# EAGLE design untitled (EAGLE 7.7.0)
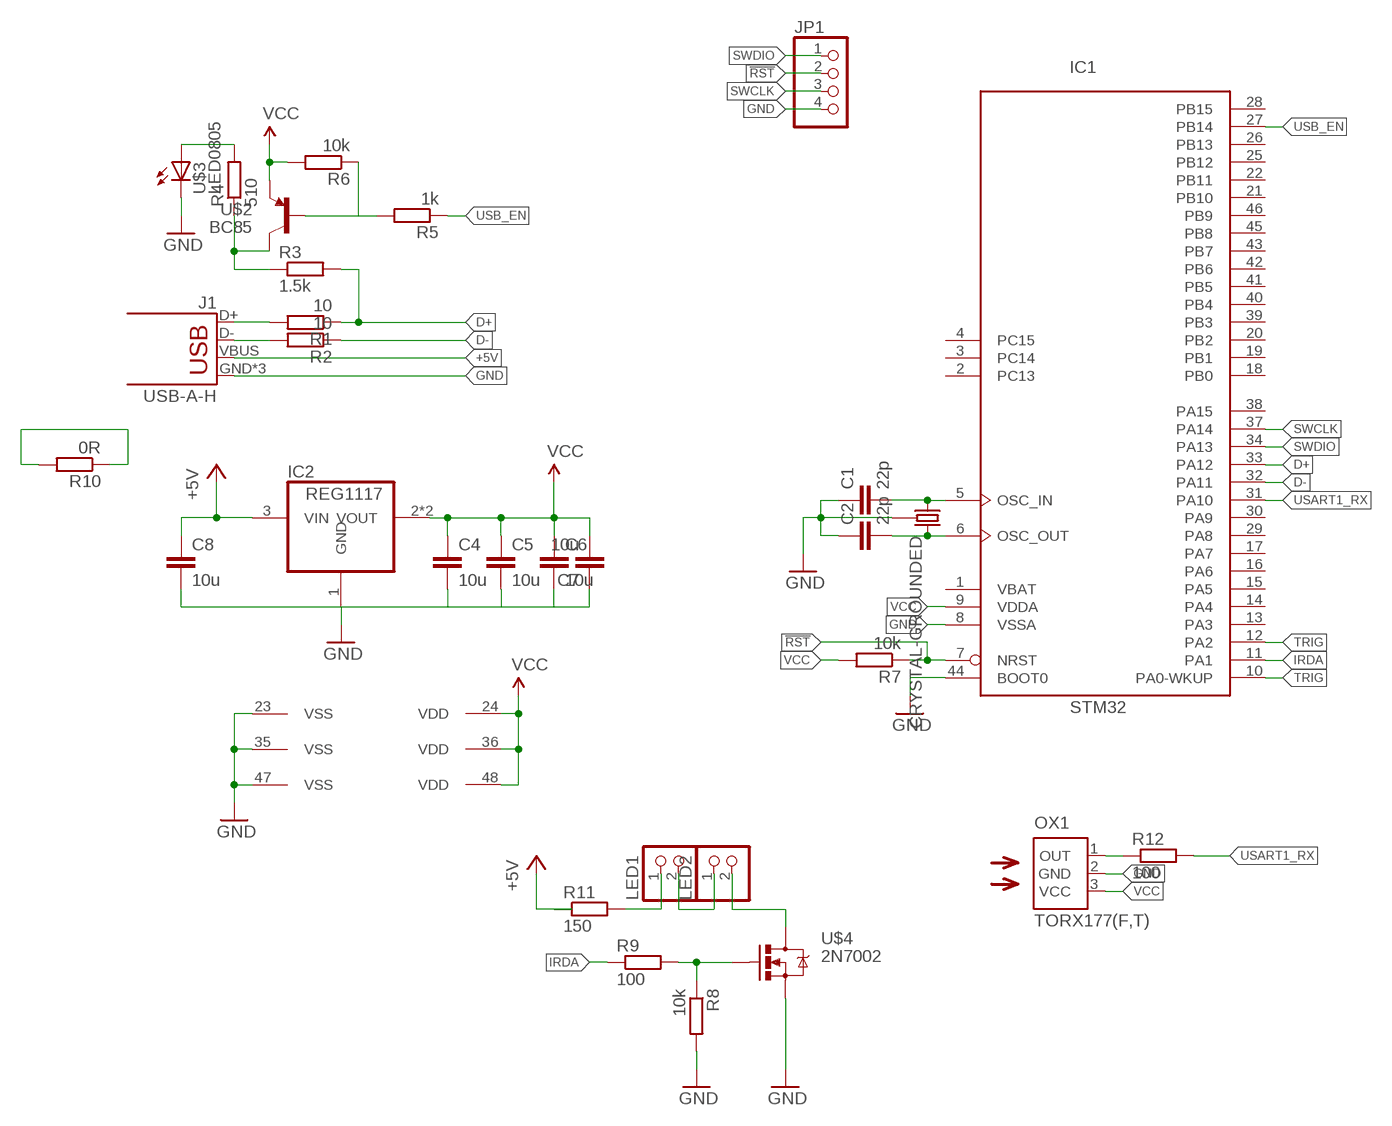
[diagram p0: schematic, sheet 1]

## Parts
C1  22p  CC0603  [C0603]
C2  22p  CC0603  [C0603]
C4  10u  CC0805  [C0805]
C5  10u  CC0805  [C0805]
C6  10u  CC0805  [C0805]
C7  10u  CC0805  [C0805]
C8  10u  CC0805  [C0805]
IC1  STM32  STM32F103C8T  [LQFP48]
IC2  REG1117  [SOT223]
J1  USB-A-H  [USB-A-H]
JP1  PINHD-1X4  [1X04]
LED1  PINHD-1X2  [1X02]
LED2  PINHD-1X2  [1X02]
OX1  TORX177(F,T)  [TORX]
R1  10  R0603  [0603]
R2  10  R0603  [0603]
R3  1.5k  R0603  [0603]
R4  510  R0603  [0603]
R5  1k  R0603  [0603]
R6  10k  R0603  [0603]
R7  10k  R0603  [0603]
R8  10k  R0603  [0603]
R9  100  R0603  [0603]
R10  0R  R0603  [0603]
R11  150  R0603  [0603]
R12  100  R0603  [0603]
U$1  CRYSTAL-GROUNDED  [CRYSTAL-SMD-5X3]
U$2  BC85  [SOT23]
U$3  LED0805  [0805-LED]
U$4  2N7002  [SOT23]

## Nets
5VRLED: LED1.1 R11.2
!RST: IC1.7(NRST) JP1.2 R7.1
+5V: C8.1 IC2.3(VIN) J1.VBUS R11.1
D+: IC1.33(PA12) R1.1 R3.2
D-: IC1.32(PA11) R2.1
GND: C1.1 C2.1 C4.2 C5.2 C6.2 C7.1 C8.2 IC1.8(VSSA) IC1.23(VSS) IC1.35(VSS) IC1.44(BOOT0) IC1.47(VSS) J1.GND J1.GND2(GND) J1.GND3(GND) JP1.4 OX1.2(GND) R8.2 U$1.2 U$1.4 U$3.C U$4.2(S)
IRDA: IC1.11(PA1) R9.1
N$1: C2.2 IC1.6(OSC_OUT) U$1.1
N$2: C1.2 IC1.5(OSC_IN) U$1.3
N$3: R8.1 R9.2 U$4.1(G)
N$4: LED2.2 U$4.3(D)
N$5: J1.D- R2.2
N$6: J1.D+ R1.2
N$7: LED1.2 LED2.1
N$9: R3.1 R4.1 U$2.3(C)
N$10: R4.2 U$3.A
N$13: R5.2 R6.1 U$2.1(B)
SWCLK: IC1.37(PA14) JP1.3
SWDIO: IC1.34(PA13) JP1.1
TRIG: IC1.10(PA0-WKUP) IC1.12(PA2)
USART1_RX: IC1.31(PA10) R12.2
USART1_RXR: OX1.1(OUT) R12.1
USB_EN: IC1.27(PB14) R5.1
VCC: C4.1 C5.1 C6.1 C7.2 IC1.9(VDDA) IC1.24(VDD) IC1.36(VDD) IC1.48(VDD) IC2.2(VOUT) IC2.4(VOUT) OX1.3(VCC) R6.2 R7.2 R10.1 R10.2 U$2.2(E)
Unconnected: IC1.2(PC13) IC1.3(PC14) IC1.4(PC15) IC1.13(PA3) IC1.14(PA4) IC1.15(PA5) IC1.16(PA6) IC1.17(PA7) IC1.18(PB0) IC1.19(PB1) IC1.20(PB2) IC1.21(PB10) IC1.22(PB11) IC1.25(PB12) IC1.26(PB13) IC1.28(PB15) IC1.29(PA8) IC1.30(PA9) IC1.38(PA15) IC1.39(PB3) IC1.40(PB4) IC1.41(PB5) IC1.42(PB6) IC1.43(PB7) IC1.45(PB8) IC1.46(PB9)

## Power pins joined to a net without a drawn wire
GND: IC2.1(GND)
VBAT: IC1.1(VBAT)

## Library data of the parts
C1 C2 C4-C8 = smalsmd:C: Capacitor
IC1 = micro-stm_v3:STM32F103C*T: ARM 32-bit Cortex™-M3 CPU 72 MHz maximum frequency 16 to 128 Kbytes of Flash memory 6 to 20 kbytes of SRAM 37 GPIOs 2.0 to 3.6 V application supply
IC2 = burr-brown:REG1117: 800mA and 1A Low Dropout (LDO) Positive Regulator 1.8V, 2.5V, 2.85V, 3.3V, 5V, and Adj; MPN: REG1117; OC_FARNELL: 1097566; OC_NEWARK: 14P6981
J1 = SparkFun-Connectors:USB: USB Connectors USB-B-PTH is fully proven SKU : PRT-00139/CONN-08278 USB-miniB is fully proven SKU : PRT-00587 USB-A-PCB is untested. USB-A-H is throughly reviewed, but untested. Spark Fun Electronics SKU : PRT-00437 USB-B-SMT is throughly reviewed, but untested. Needs silkscreen touching up. USB-A-S has not been used/tested USB-MB-H has not been used/tested USB-MICROB has been used. CONN-09505; PROD_ID: CONN-08367
JP1 = pinhead:PINHD-1X4: PIN HEADER
LED1 LED2 = pinhead:PINHD-1X2: PIN HEADER
OX1 = toslink:TORX177(F,T): FIBER OPTIC RECEIVING MODULE
R1-R12 = smalsmd:R
U$1 = SparkFun-FreqCtrl:CRYSTAL-GROUNDED
U$2 = smalsmd:BC85*
U$3 = smalsmd:LED
U$4 = smalsmd:2N7002

## Board
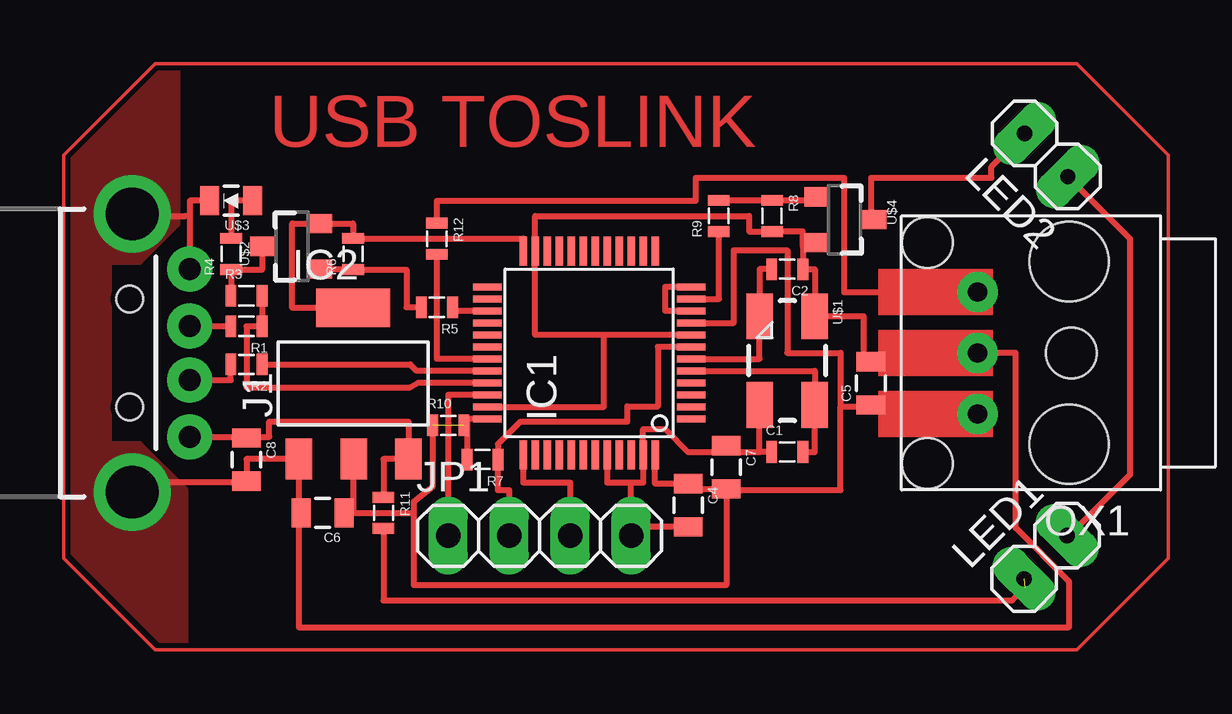
[diagram p1: board, top side]

No outline drawn. Coordinates in mm, seen from the top.
Copper layers (1*16): Top 0.035mm / dielectric 1.5mm / Bottom 0.035mm
Design rules "SparkFun": minimum track width 8mil, minimum drill 20mil, track to track 8mil, track to pad 8mil, pad to pad 8mil, via to via 8mil, smd to smd 8mil, copper to edge 10mil, drill to drill 8mil, minimum pad ring 12mil, minimum via ring 10mil, stop-mask expansion 4mil, vias tented up to drill 25mil, thermal gap 10mil

### Footprints (pad centres in the part's own frame; a part is rotated, then mirrored left to right if it is on the bottom)
C0603 = smd 0.45 x 0.9: 1 -0.65,0; 2 0.65,0
C0805 = smd 0.8 x 1.2: 1 -0.9,0; 2 0.9,0
LQFP48 = smd 0.3 x 1.2: 1 -2.75,-4.25; 2 -2.25,-4.25; 3 -1.75,-4.25; 4 -1.25,-4.25; 5 -0.75,-4.25; 6 -0.25,-4.25; 7 0.25,-4.25; 8 0.75,-4.25; 9 1.25,-4.25; 10 1.75,-4.25; 11 2.25,-4.25; 12 2.75,-4.25; 25 2.75,4.25; 26 2.25,4.25; 27 1.75,4.25; 28 1.25,4.25; 29 0.75,4.25; 30 0.25,4.25; 31 -0.25,4.25; 32 -0.75,4.25; 33 -1.25,4.25; 34 -1.75,4.25; 35 -2.25,4.25; 36 -2.75,4.25 | smd 1.2 x 0.3: 13 4.25,-2.75; 14 4.25,-2.25; 15 4.25,-1.75; 16 4.25,-1.25; 17 4.25,-0.75; 18 4.25,-0.25; 19 4.25,0.25; 20 4.25,0.75; 21 4.25,1.25; 22 4.25,1.75; 23 4.25,2.25; 24 4.25,2.75; 37 -4.25,2.75; 38 -4.25,2.25; 39 -4.25,1.75; 40 -4.25,1.25; 41 -4.25,0.75; 42 -4.25,0.25; 43 -4.25,-0.25; 44 -4.25,-0.75; 45 -4.25,-1.25; 46 -4.25,-1.75; 47 -4.25,-2.25; 48 -4.25,-2.75
SOT223 = smd 1.1 x 1.7: 1 -2.261,-3.15; 2 0.025,-3.15; 3 2.311,-3.15 | smd 3.1 x 1.6: 4 0,3.15
USB-A-H = drill 0.914 pad 1.88: D+ 2.4,1.127; D- 2.4,-1.127; GND 2.4,3.5; VBUS 2.4,-3.5 | drill 2.2: GND2 0,-5.8; GND3 0,5.8 | hole 1.1: -0.1,2.25; -0.1,-2.25
1X04 = drill 1.016 long: 1 -3.81,0; 2 -1.27,0; 3 1.27,0; 4 3.81,0
1X02 = drill 0.635 pad 1.549 long: 1 -1.27,0; 2 1.27,0
TORX = drill 0.8 pad 1.676: 1 3.81,-2.54; 2 3.81,0; 3 3.81,2.54 | hole 3.3: 0,3.81; 0,-3.81 | hole 2.1: -0.09,0; 5.91,4.6; 5.91,-4.6
0603 = smd 0.45 x 0.9: 1 -0.65,0; 2 0.65,0
CRYSTAL-SMD-5X3 = smd 1.9 x 1.1: 1 -1.85,-1.15; 2 1.85,-1.15; 3 1.85,1.15; 4 -1.85,1.15
SOT23 = smd 0.8 x 1: 1 -0.95,-1.159; 2 0.95,-1.159; 3 0,1.259
0805-LED = smd 0.8 x 1.2: A -0.9,0; C 0.9,0

### Placement (x,y rotation side)
C1  -30.16,17.78 0 top
C2  -30.16,25.4 180 top
C4  -34.29,15.56 270 top
C5  -26.67,20.64 90 top
C6  -49.53,15.24 180 top
C7  -32.7,17.14 270 top
C8  -52.7,17.46 270 top
IC1  -38.42,21.91 90 top
IC2  -48.26,20.64 0 top
J1  -57.47,21.91 0 top
JP1  -40.48,14.29 0 top
LED1  -19.39,13.39 45 top
LED2  -19.37,30.16 135 top
OX1  -18.41,21.91 180 top
R1  -52.7,23.02 180 top
R2  -52.7,21.43 180 top
R3  -52.7,24.29 0 top
R4  -53.34,26.04 90 top
R5  -44.77,23.81 180 top
R6  -48.26,26.04 90 top
R7  -42.86,17.46 180 top
R8  -30.8,27.62 270 top
R9  -33.02,27.62 90 top
R10  -44.29,18.89 0 top
R11  -46.99,15.24 270 top
R12  -44.77,26.67 270 top
U$1  -30.16,21.59 270 top
U$2  -50.8,26.35 90 top
U$3  -53.34,28.26 180 top
U$4  -27.78,27.46 270 top

### Tracks (layer width: path | path; a pad name or v marks a point on that pad's centre or on a via)
5VRLED  (1 unrouted)
  Top 0.254: R11.2 -46.99,11.59 -20.8,11.59 -20.27,12.12
!RST
  Top 0.254: IC1.7 -35.56,22.16 -35.56,19.68 -36.83,19.68 -36.83,19.05 -41.27,19.05 -42.23,18.1 -42.21,18.1 R7.1 -42.23,17.46 -42.23,16.19 -41.75,16.19 JP1.2
+5V
  Top 0.254: J1.VBUS -52.7,18.41 | -52.7,18.41 -51.75,18.41 -51.75,19.05 -45.95,19.05 IC2.3 -46.99,17.49 R11.1 | C8.1 -52.7,18.41
D+
  Top 0.254: IC1.33 -45.54,20.66 -45.88,20.48 -52.7,20.48 -52.7,23.02 R1.1 R3.2
D-
  Top 0.254: R2.1 -45.88,21.43 -45.6,21.16 IC1.32
GND
  Top 0.254: C8.2 -52.7,17.49 IC2.1 -50.52,15.24 | C8.2 -52.7,16.51 -53.34,16.51 | -53.34,16.51 -57.47,16.51 -57.47,16.19 | C8.2 -53.34,16.51 | C6.2 -50.52,15.24 | C1.1 -31.31,17.78 | -31.31,17.78 U$1.2 | IC1.44 -37.67,16.51 -36.67,16.51 | -36.67,16.51 -36.17,16.51 IC1.47 -36.17,18.73 -35.24,18.73 -34.29,17.78 -32.7,17.78 | -36.67,16.51 JP1.4 -36.78,14.66 C4.2 | -32.7,17.78 -31.31,17.78 | IC1.35 -37.81,19.66 -37.81,22.66 | IC1.8 -37.81,22.66 | C7.1 -32.7,17.78 | -50.52,15.24 -50.52,10.48 -18.41,10.48 -18.41,12.38 -20.64,14.61 -20.64,21.91 OX1.2 -22.86,21.59 -25.08,21.59 C5.2 -26.67,21.59 -26.99,21.59 -26.99,23.44 U$1.4 -29.01,25.4 C2.1 -29.51,26.36 | -37.81,22.66 -40.67,22.66 IC1.23 -40.67,27.62 -31.75,27.62 -31.75,26.97 R8.2 -29.51,26.97 -29.51,26.36 | U$3.C -55.07,28.26 J1.GND | -57.47,27.62 -55.24,27.62 | U$4.2 -29.51,26.36
  pour Top (isolate 0.1, no thermals): -57.15,25.72 -55.56,27.3 -55.56,33.66 -56.52,33.66 -60.01,30.16 -60.01,13.65 -56.2,9.84 -55.24,9.84 -55.24,16.19 -57.15,18.1 -58.42,18.1 -58.42,25.72
IRDA
  Top 0.254: IC1.11 -33.01,24.16 -33.01,26.99 -33.02,26.99 R9.1
N$1
  Top 0.254: C2.2 -31.31,25.4 U$1.1 -31.31,21.66 IC1.6
N$2
  Top 0.254: IC1.5 -29.01,21.16 U$1.3 -29.01,17.78 C1.2
N$3
  Top 0.254: R9.2 R8.1 -29.26,28.27 U$4.1
N$4
  Top 0.254: LED2.2 -21.65,29.68 -21.65,29.21 -26.67,29.21 -26.67,27.3 U$4.3
N$5
  Top 0.254: J1.D- -53.35,20.78 R2.2
N$6
  Top 0.254: R1.2 -55.07,23.02 J1.D+
N$7
  Top 0.254: LED2.1 -15.88,26.67 -15.88,16.83 -18.41,14.29 LED1.2
N$8
  Top 0.152: -56.52,33.97 -18.1,33.97 -14.29,30.16 -14.29,13.34 -18.1,9.53 -56.52,9.53 -60.33,13.34 -60.33,30.16 -56.52,33.97
N$9
  Top 0.254: U$2.3 -52.05,25.39 R4.1 R3.1
N$10
  Top 0.254: U$3.A -53.34,28.26 R4.2
N$11  (via drill 1)
  other vias: -18.41,25.72
N$12  (via drill 1)
  other vias: -18.41,18.1
N$13
  Top 0.254: U$2.1 -48.26,25.4 R6.1 -46.04,25.39 -46.04,23.81 R5.2
SWCLK
  Top 0.254: IC1.37 -41.17,16.51 -39.21,16.51 JP1.3
SWDIO
  Top 0.254: IC1.34 -44.29,20.16 JP1.1
TRIG
  Top 0.254: IC1.10 -35.24,23.66 -35.24,24.66 IC1.12
USART1_RX  (1 unrouted)
  Top 0.254: IC1.31 -44.77,21.66 -44.77,26.04
USART1_RXR  (1 unrouted)
  Top 0.254: OX1.1 -27.78,24.45 -27.78,29.21 -33.97,29.21 -33.97,28.26 -44.77,28.26 -44.77,27.3
USB_EN
  Top 0.254: IC1.27 -44.12,23.66 R5.1
VCC  (2 unrouted)
  Top 0.254: IC2.4 -50.8,23.79 -50.8,27.3 U$2.2 | U$2.2 | U$2.2 -48.26,27.3 R6.2 -41.17,26.68 IC1.24 -41.17,26.35 | C6.1 -48.26,15.24 | -48.26,15.24 -48.23,15.24 | -48.23,15.24 IC2.2 -48.26,17.49 -48.26,15.24 | IC1.36 -43.51,19.16 -43.51,18.76 | -43.51,18.76 R7.2 | IC1.48 -35.67,16.46 C4.1 -34.29,16.25 C7.2 | IC1.9 -32.38,23.16 -32.38,26.19 -30.16,26.19 -30.16,21.91 -27.94,21.91 -27.94,19.68 | -27.94,19.68 -25.4,19.68 | -25.4,19.68 C5.1 | -25.4,19.68 -22.86,19.68 OX1.3 | -48.23,15.24 -45.72,15.24 | -45.72,15.24 -45.72,15.72 -44.93,16.35 -44.93,18.89 | C7.2 -32.7,16.46 | C7.2 -32.7,12.22 -45.72,12.22 -45.72,15.24 | R10.2 -43.51,18.76 | C7.2 -32.7,16.19 -27.94,16.19 -27.94,19.68
(copper drawn outside any net)
  shapes: Top area x4

### Text on the board
Top: USB TOSLINK